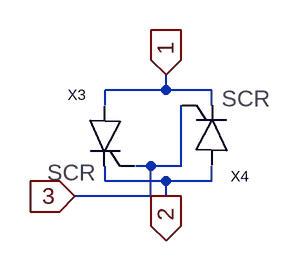
[diagram p0: schematic CAS14cx.asc]
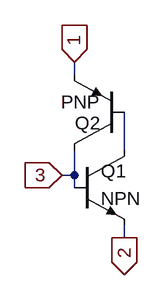
[diagram p1: sub-circuit cas14bx.asc]
CAS14cx.asc, the LTspice schematic file:
Version 4
SHEET 1 880 680
WIRE 80 176 80 160
WIRE 80 176 16 176
WIRE 128 176 80 176
WIRE 16 192 16 176
WIRE 128 192 128 176
WIRE 64 256 48 256
WIRE 96 256 96 192
WIRE 96 256 64 256
WIRE 16 272 16 256
WIRE 80 272 16 272
WIRE 128 272 128 256
WIRE 128 272 80 272
WIRE 64 288 64 256
WIRE 64 288 -16 288
WIRE 80 288 80 272
FLAG 80 160 1
IOPIN 80 160 In
FLAG -16 288 3
IOPIN -16 288 In
FLAG 80 288 2
IOPIN 80 288 Out
SYMBOL CAS14bx 48 208 M0
SYMATTR InstName X3
SYMBOL CAS14bx 96 240 M180
SYMATTR InstName X4

cas14bx.asc, the sub-circuit schematic file:
Version 4
SHEET 1 880 680
WIRE 160 144 160 128
WIRE 224 240 224 192
WIRE 160 272 160 240
WIRE 160 272 144 272
WIRE 160 288 160 272
WIRE 224 352 224 336
FLAG 160 128 1
IOPIN 160 128 In
FLAG 144 272 3
IOPIN 144 272 In
FLAG 224 352 2
IOPIN 224 352 Out
SYMBOL npn 160 240 R0
WINDOW 0 34 27 Left 2
WINDOW 3 34 62 Left 2
SYMATTR InstName Q1
SYMBOL pnp 224 240 R180
WINDOW 0 31 34 Left 2
WINDOW 3 32 61 Left 2
SYMATTR InstName Q2

The netlist it stands for:
* CAS14cx.asc
XX3 1 2 3 cas14bx
XX4 2 1 3 cas14bx

* block symbol definitions
.subckt cas14bx 1 2 3
Q1 N001 3 2 0 NPN
Q2 3 N001 1 0 PNP
.ends cas14bx

.model NPN NPN
.model PNP PNP
.lib standard.bjt
.backanno
.end